# EasyEDA schematic SCH_MotorDriver_2025-03-28.json
TITLE: Sheet_1; REV: 1.0; Date: 2025-03-26; Sheet: 1/1; Drawn By: otaku101; Company: Your Company
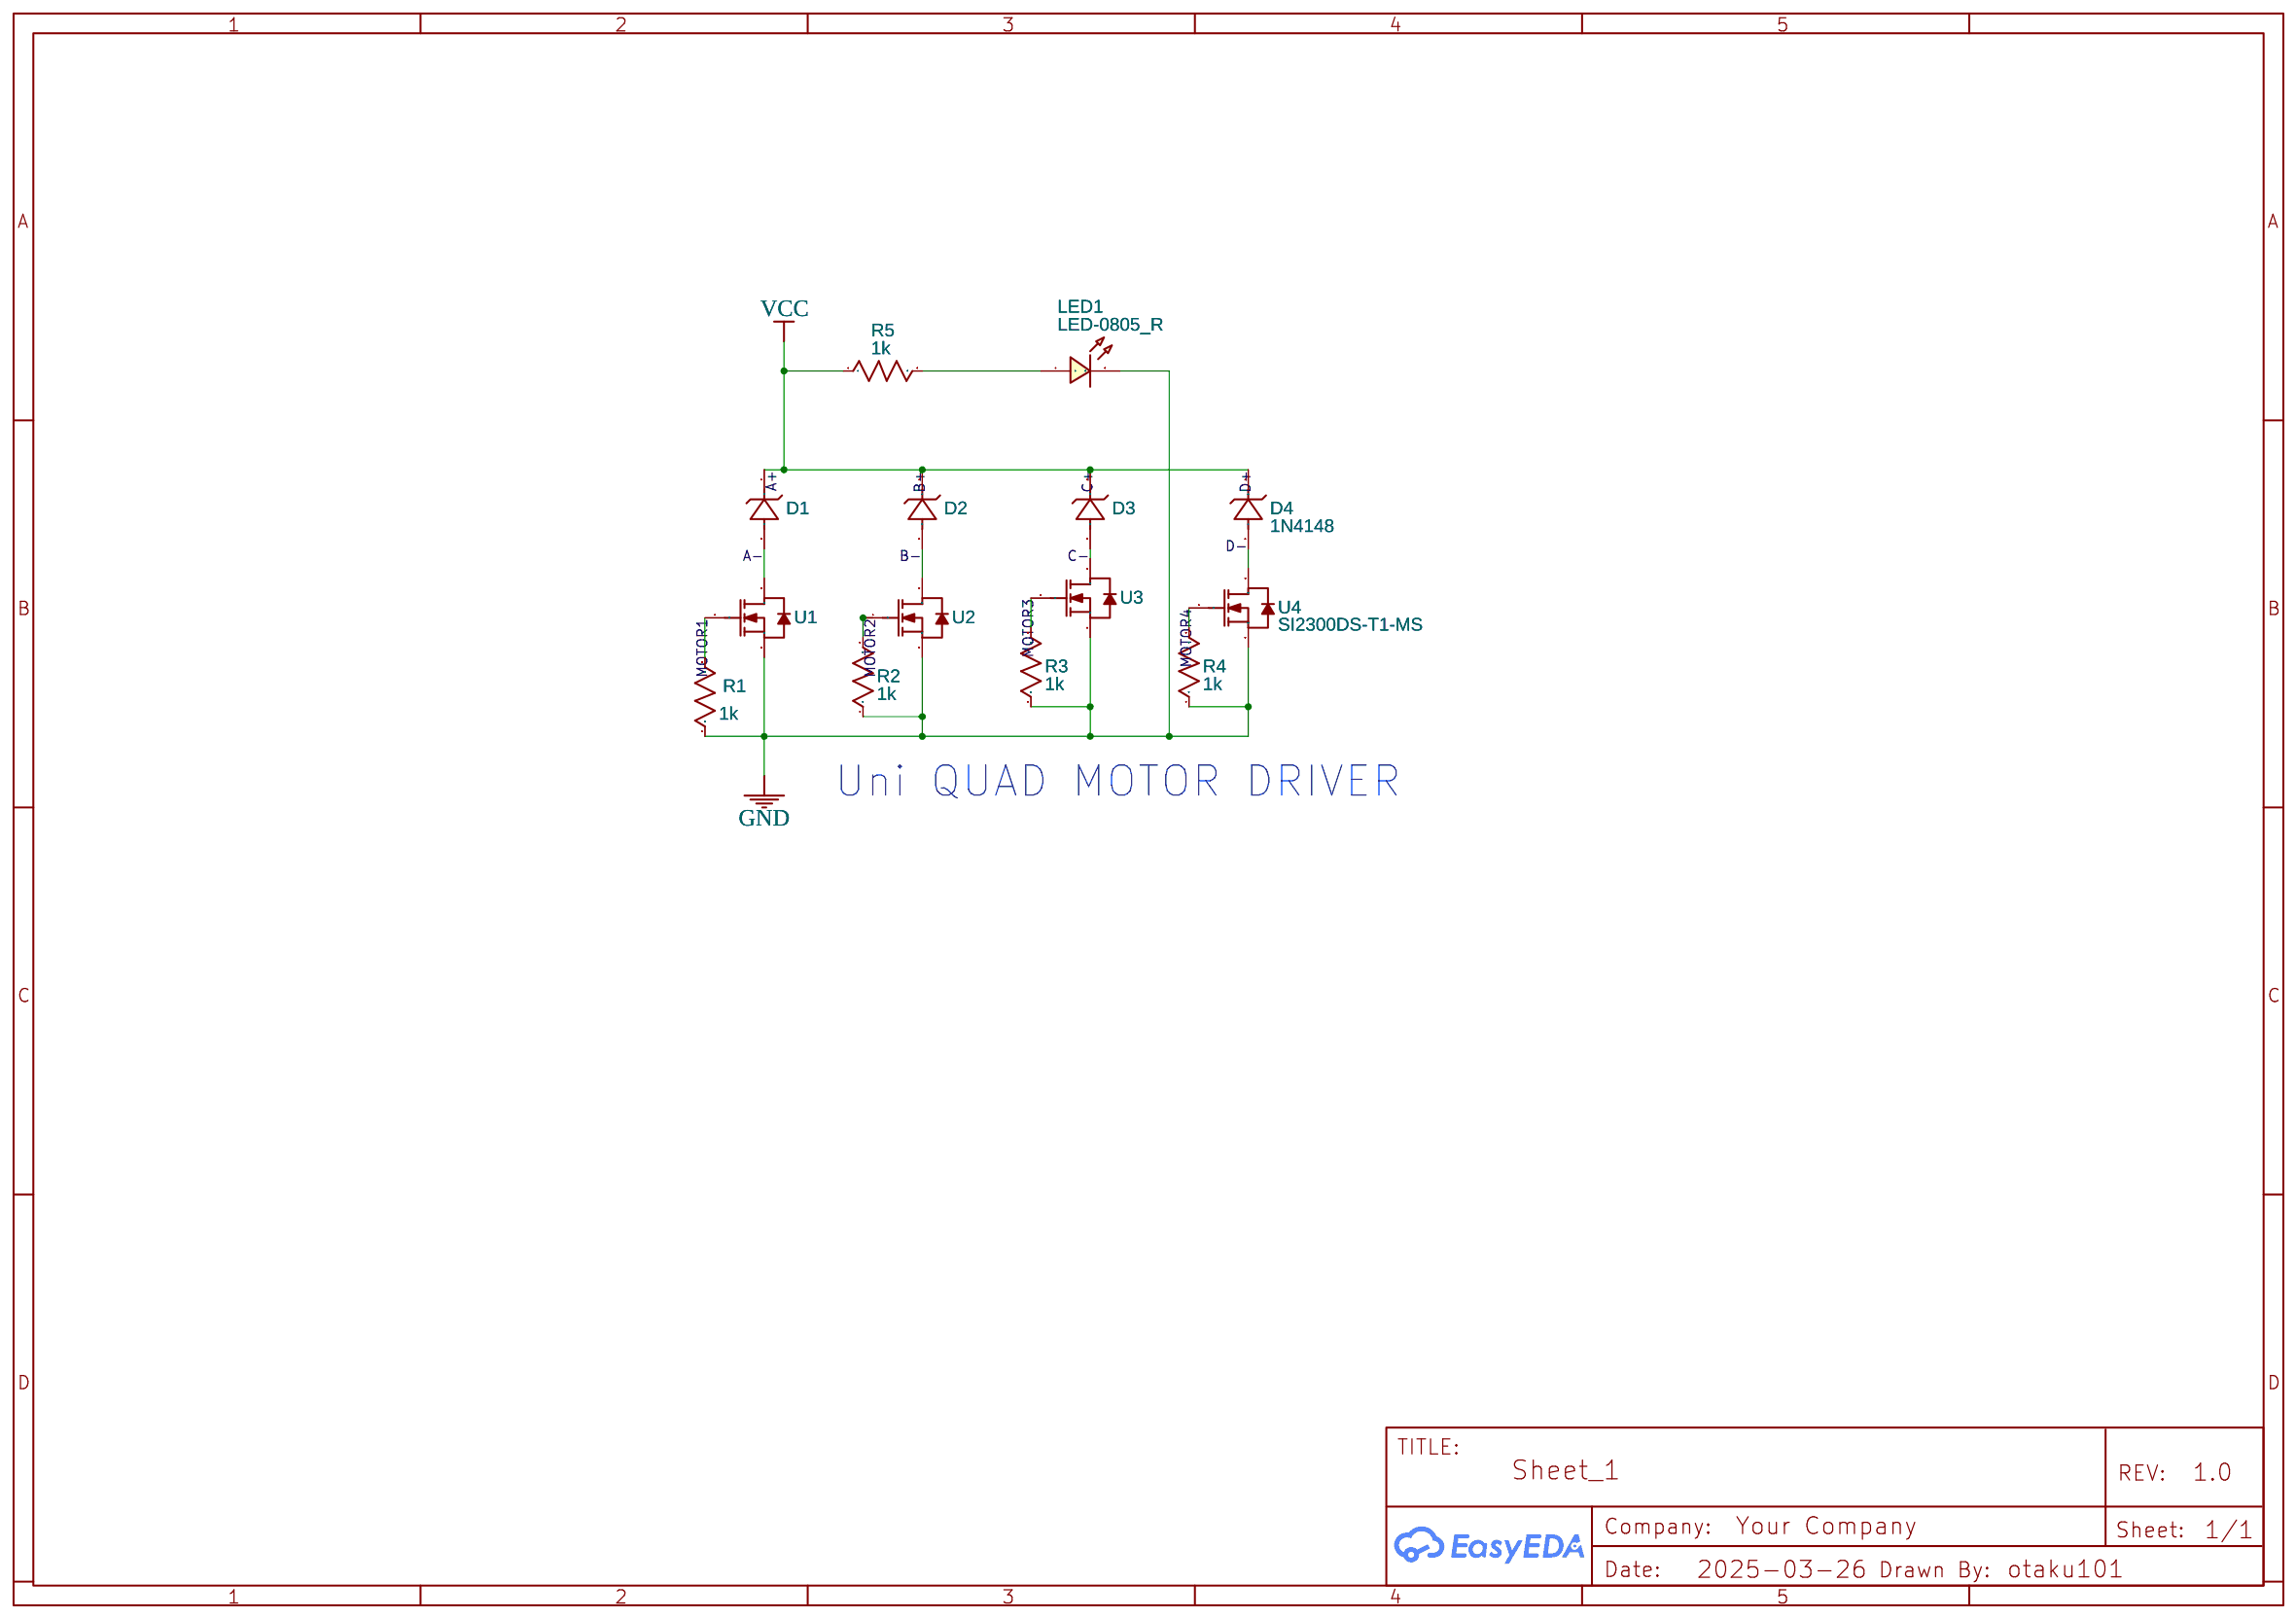
[diagram p0: schematic sheet]

## Parts
D1  WFR1N4148WT  [SOD-523F_L1.2-W0.8-LS1.7-RD]
D2  WFR1N4148WT  [SOD-523F_L1.2-W0.8-LS1.7-RD]
D3  WFR1N4148WT  [SOD-523F_L1.2-W0.8-LS1.7-RD]
D4  1N4148  [SOD-523F_L1.2-W0.8-LS1.7-RD]
LED1  LED-0805_R  [LED0805_RED]
R1  1k  [R0805]
R2  1k  [R0805]
R3  1k  [R0805]
R4  1k  [R0805]
R5  1k  [R0805]
U1  SI2300DS-T1-MS  [SOT-23-3_L2.9-W1.6-P1.90-LS2.8-BR]
U2  SI2300DS-T1-MS  [SOT-23-3_L2.9-W1.6-P1.90-LS2.8-BR]
U3  SI2300DS-T1-MS  [SOT-23-3_L2.9-W1.6-P1.90-LS2.8-BR]
U4  SI2300DS-T1-MS  [SOT-23-3_L2.9-W1.6-P1.90-LS2.8-BR]

## Library data of the parts
D1-D4 = WFR1N4148WT: Supplier: LCSC; Supplier Part: C5247949; Manufacturer: Wayon(上海维安); JLCPCB Part Class: Extended Part; Contributor: lcsc
LED1 = LED-0805_R: Manufacturer: EVERLIGHT(台湾亿光); Manufacturer Part: 17-21SURC/S530-A3/TR8; Supplier Part: C72037; Contributor: LCEDA_Lib
R1-R5 = R_0805_US: Contributor: LCEDA_Lib
U1-U4 = SI2300DS-T1-MS: Contributor: lcsc; Supplier: LCSC; Supplier Part: C5278005; Manufacturer: MSKSEMI(美森科); JLCPCB Part Class: Extended Part

## Nets
GND: LED1.2 R1.1 R2.1 R3.1 R4.1 U1.2(S) U2.2(S) U3.2(S) U4.2(S)
A+: D1.1(C) D2.1(C) D3.1(C) D4.1(C) R5.1
A-: D1.2(A) U1.3(D)
B-: D2.2(A) U2.3(D)
C-: D3.2(A) U3.3(D)
D-: D4.2(A) U4.3(D)
MOTOR1: R1.2 U1.1(G)
MOTOR2: R2.2 U2.1(G)
MOTOR3: R3.2 U3.1(G)
MOTOR4: R4.2 U4.1(G)
Net-(LED1-1): LED1.1 R5.2

## Notes on the sheet
- Uni QUAD MOTOR DRIVER
